# Altium schematic sheet FPGA_51_VIDEO.SchDoc
size B; Organization: Altium Limited; Address1: L3, 12a Rodborough Rd; Address2: Frenchs Forest; Address3: NSW; Address4: Australia 2086; DocumentNumber: 1; SheetNumber: 1; SheetTotal: 3
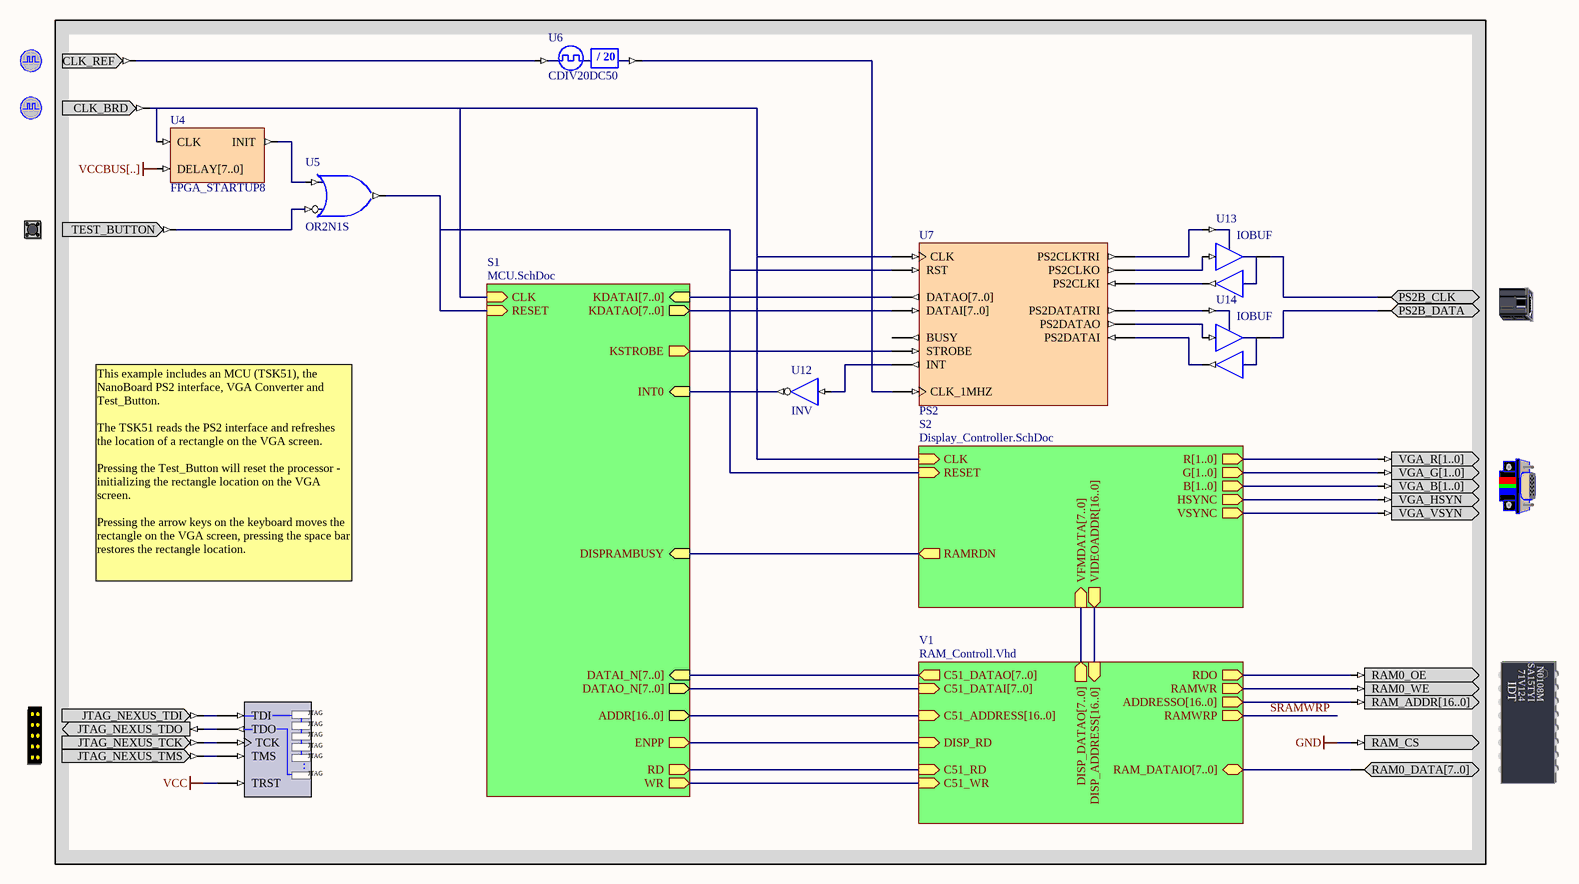
[diagram p0: FPGA_51_VIDEO.SchDoc]

## Parts
(Parts that share a designator on the sheet are numbered #1, #2 ... from top to bottom, then left to right.)
?#1  CLOCK_REFERENCE  (value not drawn)
?#2  CLOCK_BOARD  (value not drawn)
?#3  TEST_BUTTON  (value not drawn)
?#4  PS2B  (value not drawn)
?#5  VGACNTR  (value not drawn)
?#6  NEXUS_JTAG_CONNECTOR  (value not drawn)
?#7  MEMORY0  (value not drawn)
NEXUS_JTAG_PORT  NEXUS_JTAG_PORT  (value not drawn)
U4  FPGA_STARTUP8
U5  OR2N1S
U6  CDIV20DC50
U7  PS2
U12  INV
U13  IOBUF
U14  IOBUF

## Sub-sheets
S1 = MCU.SchDoc: CLK (in), RESET (in), WR (out), RD (out), DATAI_N[7..0] (in), ADDR[16..0] (out), DATAO_N[7..0] (out), DISPRAMBUSY (in), INT0 (in), ENPP (out), KDATAI[7..0] (in), KSTROBE (out), KDATAO[7..0] (out)
S2 = Display_Controller.SchDoc: CLK (in), RESET (in), HSYNC (out), VSYNC (out), R[1..0] (out), G[1..0] (out), VIDEOADDR[16..0] (out), RAMRDN (out), VFMDATA[7..0] (in), B[1..0] (out)
V1 = RAM_Controll.Vhd: ADDRESSO[16..0] (out), C51_ADDRESS[16..0] (in), C51_DATAI[7..0] (in), C51_DATAO[7..0] (out), C51_RD (in), C51_WR (in), DISP_ADDRESS[16..0] (in), DISP_DATAO[7..0] (out), DISP_RD (in), RAM_DATAIO[7..0] (bidir), RAMWR (out), RDO (out), RAMWRP (out)  | VHDLENTITY: RAM_Controll

## Nets
GND: ?#7.RAM_CS
VCC: NEXUS_JTAG_PORT.TRST
VCCBUS[..]: U4.DELAY[7..0]
SRAMWRP: sheet V1/RAMWRP
Net?#1_CLK_REF: ?#1.CLK_REF U6.CLKIN
Net?#2_CLK_BRD: ?#2.CLK_BRD U4.CLK U7.CLK ; sheet S2/CLK, sheet S1/CLK
Net?#3_TEST_BUTTON: ?#3.TEST_BUTTON U5.I0
Net?#4_PS2B_CLK: ?#4.PS2B_CLK U13.IO
Net?#4_PS2B_DATA: ?#4.PS2B_DATA U14.IO
Net?#5_VGA_B[1..0]: ?#5.VGA_B[1..0] ; sheet S2/B[1..0]
Net?#5_VGA_G[1..0]: ?#5.VGA_G[1..0] ; sheet S2/G[1..0]
Net?#5_VGA_HSYN: ?#5.VGA_HSYN ; sheet S2/HSYNC
Net?#5_VGA_R[1..0]: ?#5.VGA_R[1..0] ; sheet S2/R[1..0]
Net?#5_VGA_VSYN: ?#5.VGA_VSYN ; sheet S2/VSYNC
Net?#6_JTAG_NEXUS_TCK: ?#6.JTAG_NEXUS_TCK NEXUS_JTAG_PORT.TCK
Net?#6_JTAG_NEXUS_TDI: ?#6.JTAG_NEXUS_TDI NEXUS_JTAG_PORT.TDI
Net?#6_JTAG_NEXUS_TDO: ?#6.JTAG_NEXUS_TDO NEXUS_JTAG_PORT.TDO
Net?#6_JTAG_NEXUS_TMS: ?#6.JTAG_NEXUS_TMS NEXUS_JTAG_PORT.TMS
Net?#7_RAM0_DATA[7..0]: ?#7.RAM0_DATA[7..0] ; sheet V1/RAM_DATAIO[7..0]
Net?#7_RAM0_OE: ?#7.RAM0_OE ; sheet V1/RDO
Net?#7_RAM0_WE: ?#7.RAM0_WE ; sheet V1/RAMWR
Net?#7_RAM_ADDR[16..0]: ?#7.RAM_ADDR[16..0] ; sheet V1/ADDRESSO[16..0]
NetU4_INIT: U4.INIT U5.I1
NetU5_O: U5.O U7.RST ; sheet S2/RESET, sheet S1/RESET
NetU6_CLKDV: U6.CLKDV U7.CLK_1MHZ
NetU7_DATAI[7..0]: U7.DATAI[7..0] ; sheet S1/KDATAO[7..0]
NetU7_DATAO[7..0]: U7.DATAO[7..0] ; sheet S1/KDATAI[7..0]
NetU7_INT: U7.INT U12.I
NetU7_PS2CLKI: U7.PS2CLKI U13.O
NetU7_PS2CLKO: U7.PS2CLKO U13.I
NetU7_PS2CLKTRI: U7.PS2CLKTRI U13.T
NetU7_PS2DATAI: U7.PS2DATAI U14.O
NetU7_PS2DATAO: U7.PS2DATAO U14.I
NetU7_PS2DATATRI: U7.PS2DATATRI U14.T
NetU7_STROBE: U7.STROBE ; sheet S1/KSTROBE
NetU12_O: U12.O ; sheet S1/INT0
(unnamed): sheet S2/RAMRDN, sheet S1/DISPRAMBUSY
(unnamed): sheet V1/C51_RD, sheet S1/RD
(unnamed): sheet V1/C51_WR, sheet S1/WR
(unnamed): sheet V1/DISP_RD, sheet S1/ENPP

Not connected (* = marked no-connect by the designer): U7 BUSY

## Buses and harness runs
bus sheet S1/ADDR[16..0] = sheet V1/C51_ADDRESS[16..0]
bus sheet S1/DATAI_N[7..0] = sheet V1/C51_DATAO[7..0]
bus sheet S1/DATAO_N[7..0] = sheet V1/C51_DATAI[7..0]
bus sheet S2/VFMDATA[7..0] = sheet V1/DISP_DATAO[7..0]
bus sheet S2/VIDEOADDR[16..0] = sheet V1/DISP_ADDRESS[16..0]

## Notes on the sheet
- This example includes an MCU (TSK51), the NanoBoard PS2 interface, VGA Converter and Test_Button.
  The TSK51 reads the PS2 interface and refreshes the location of a rectangle on the VGA screen.
  Pressing the Test_Button will reset the processor - initializing the rectangle location on the VGA screen.
  Pressing the arrow keys on the keyboard moves the rectangle on the VGA screen, pressing the space bar restores the rectangle location.
- Title
- Size:
- Date:
- B
- Number:
- Time:
- Revision:
- Sheet
- of
- File:
- (in symbol CDIV20DC50) / 20
- (in symbol MEMORY0) IDT; 71V124; SA15TYI; N0108M
- (in symbol NEXUS_JTAG_PORT) JTAG; .

## Library data of the parts
?#1 = CLOCK_REFERENCE: Global System Clock Reference Supply; PortComponent: True; Published: 19-Nov-2003; Publisher: Altium Limited
?#2 = CLOCK_BOARD: Global System Clock Supply; PortComponent: True; Published: 19-Nov-2003; Publisher: Altium Limited
?#3 = TEST_BUTTON: Test Button; PortComponent: True; Published: 19-Nov-2003; Publisher: Altium Limited
?#4 = PS2B: Key Board PS2 Connector; PortComponent: True; Published: 19-Nov-2003; Publisher: Altium Limited
?#5 = VGACNTR: VGA Dsub-15-Female-HD; PortComponent: True; Published: 19-Nov-2003; Publisher: Altium Limited
?#6 = NEXUS_JTAG_CONNECTOR: JTAG Port; PortComponent: True; Published: 19-Nov-2003; Publisher: Altium Limited
?#7 = MEMORY0: SRAM - 0 Module; PortComponent: True; Published: 19-Nov-2003; Publisher: Altium Limited
NEXUS_JTAG_PORT = NEXUS_JTAG_PORT: Soft Nexus-Chain Connector; NEXUS_JTAG_CONNECTOR: True; Published: 18-Dec-2003; Publisher: Altium Limited
U4 = FPGA_STARTUP8: FPGA Startup With 8 Bit Delay; Published: 21/01/2004; Publisher: Altium Hobart Technology Centre; Core Revision: 1.00.00
U5 = OR2N1S: 2-Input OR Gate with Active Low A Input, Single Pin Version; Xilinx Equivalent: OR2B1; ArchiveName: GENERIC; Published: 18-Dec-2003; Publisher: Altium Limited; Core Revision: 1.00.00
U6 = CDIV20DC50: Clock Divider by 20 with 50% Duty Cycle Output; ArchiveName: GENERIC; VHDLIB_SIM: GENERIC_LIB; Published: 29-Jan-2004; Publisher: Altium Limited; Core Revision: 1.00.00
U7 = PS2: PS2 Controller; Published: 3/02/2004; Publisher: Altium Hobart Technology Centre; Core Revision: 1.00.00
U12 = INV: Inverter; ArchiveName: GENERIC; Published: 18-Nov-2003; Publisher: Altium Limited; Xilinx Equivalent: INV; Core Revision: 1.00.00
U13 U14 = IOBUF: Input/Output Buffer; ArchiveName: GENERIC; Published: 18-Nov-2003; Publisher: Altium Limited; Xilinx Equivalent: IOBUF; Core Revision: 1.00.00